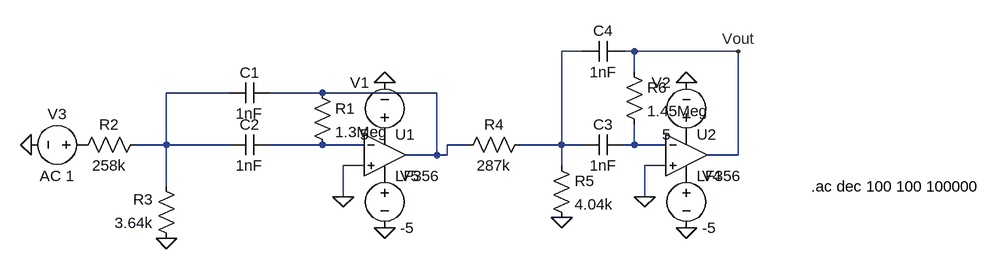
[diagram p0: schematic Butterworth_amplifier_10dB.asc]
Butterworth_amplifier_10dB.asc, the LTspice schematic file:
Version 4
SHEET 1 1176 680
WIRE 544 -16 512 -16
WIRE 624 -16 608 -16
WIRE 784 -16 624 -16
WIRE 624 16 624 -16
WIRE 0 48 -96 48
WIRE 144 48 64 48
WIRE 320 48 144 48
WIRE -96 128 -96 48
WIRE -96 128 -144 128
WIRE 0 128 -96 128
WIRE 144 128 64 128
WIRE 208 128 144 128
WIRE 368 128 336 128
WIRE 512 128 512 -16
WIRE 512 128 448 128
WIRE 544 128 512 128
WIRE 624 128 624 96
WIRE 624 128 608 128
WIRE 672 128 624 128
WIRE 320 144 320 48
WIRE 320 144 272 144
WIRE 336 144 336 128
WIRE 336 144 320 144
WIRE 784 144 784 -16
WIRE 784 144 736 144
WIRE 208 160 176 160
WIRE 512 160 512 128
WIRE 672 160 640 160
WIRE -96 192 -96 128
WIRE 176 208 176 160
WIRE 640 208 640 160
FLAG 640 208 0
FLAG 512 240 0
FLAG 176 208 0
FLAG -96 272 0
FLAG -304 128 0
FLAG 240 32 0
FLAG 704 32 0
FLAG 240 256 0
FLAG 704 256 0
FLAG 784 -16 Vout
SYMBOL OpAmps\\LF356 240 80 R0
SYMATTR InstName U1
SYMBOL res 128 32 R0
SYMATTR InstName R1
SYMATTR Value 1.3Meg
SYMBOL cap 64 32 R90
WINDOW 0 0 32 VBottom 2
WINDOW 3 32 32 VTop 2
SYMATTR InstName C1
SYMATTR Value 1nF
SYMBOL cap 64 112 R90
WINDOW 0 0 32 VBottom 2
WINDOW 3 32 32 VTop 2
SYMATTR InstName C2
SYMATTR Value 1nF
SYMBOL res -128 112 R90
WINDOW 0 0 56 VBottom 2
WINDOW 3 32 56 VTop 2
SYMATTR InstName R2
SYMATTR Value 258k
SYMBOL res -80 288 R180
WINDOW 0 36 76 Left 2
WINDOW 3 36 40 Left 2
SYMATTR InstName R3
SYMATTR Value 3.64k
SYMBOL res 464 112 R90
WINDOW 0 0 56 VBottom 2
WINDOW 3 32 56 VTop 2
SYMATTR InstName R4
SYMATTR Value 287k
SYMBOL res 496 144 R0
SYMATTR InstName R5
SYMATTR Value 4.04k
SYMBOL cap 608 112 R90
WINDOW 0 0 32 VBottom 2
WINDOW 3 32 32 VTop 2
SYMATTR InstName C3
SYMATTR Value 1nF
SYMBOL cap 608 -32 R90
WINDOW 0 0 32 VBottom 2
WINDOW 3 32 32 VTop 2
SYMATTR InstName C4
SYMATTR Value 1nF
SYMBOL res 608 0 R0
SYMATTR InstName R6
SYMATTR Value 1.45Meg
SYMBOL OpAmps\\LF356 704 80 R0
SYMATTR InstName U2
SYMBOL voltage -208 128 R90
WINDOW 0 -32 56 VBottom 2
WINDOW 3 32 56 VTop 2
WINDOW 123 0 0 Left 0
WINDOW 39 0 0 Left 0
SYMATTR InstName V3
SYMATTR Value AC 1
SYMBOL voltage 240 128 R180
WINDOW 0 24 96 Left 2
WINDOW 3 24 16 Left 2
WINDOW 123 0 0 Left 0
WINDOW 39 0 0 Left 0
SYMATTR InstName V1
SYMATTR Value 5
SYMBOL voltage 704 128 R180
WINDOW 0 24 96 Left 2
WINDOW 3 24 16 Left 2
WINDOW 123 0 0 Left 0
WINDOW 39 0 0 Left 0
SYMATTR InstName V2
SYMATTR Value 5
SYMBOL voltage 704 160 R0
WINDOW 123 0 0 Left 0
WINDOW 39 0 0 Left 0
SYMATTR InstName V4
SYMATTR Value -5
SYMBOL voltage 240 160 R0
WINDOW 123 0 0 Left 0
WINDOW 39 0 0 Left 0
SYMATTR InstName V5
SYMATTR Value -5
TEXT 896 192 Left 2 !.ac dec 100 100 100000

The netlist it stands for:
* Butterworth_amplifier_10dB.asc
XU1 0 N004 P001 P002 N003 LF356  ; pins In+ In- V+ V- OUT
R1 N003 N004 1.3Meg
C1 N003 N002 1nF
C2 N004 N002 1nF
R2 N002 P003 258k
R3 0 N002 3.64k
R4 N001 N003 287k
R5 N001 0 4.04k
C3 N005 N001 1nF
C4 Vout N001 1nF
R6 Vout N005 1.45Meg
XU2 0 N005 P004 P005 Vout LF356  ; pins In+ In- V+ V- OUT
V3 P003 0 AC 1
V1 P001 0 5
V2 P004 0 5
V4 P005 0 -5
V5 P002 0 -5
.ac dec 100 100 100000
.lib LF356.sub
.backanno
.end